# Altium schematic sheet DolphinController.SchDoc
size C
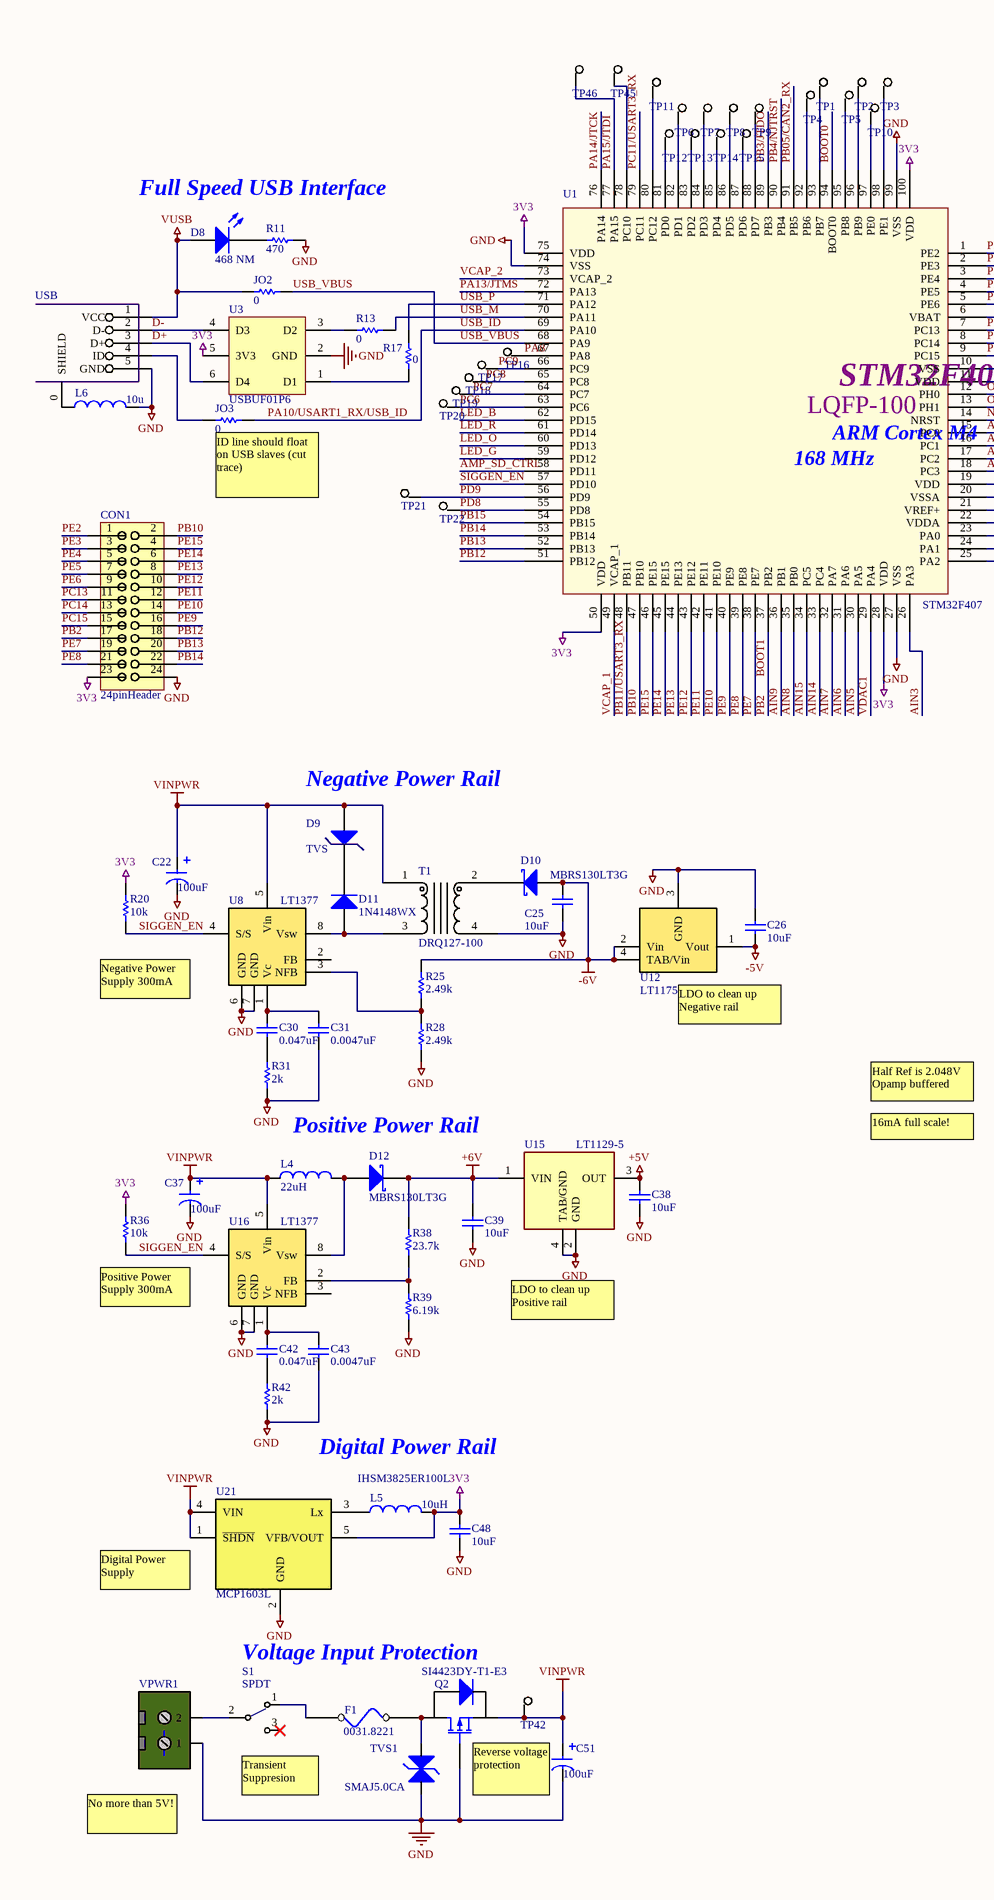
[diagram p0: DolphinController.SchDoc, left]
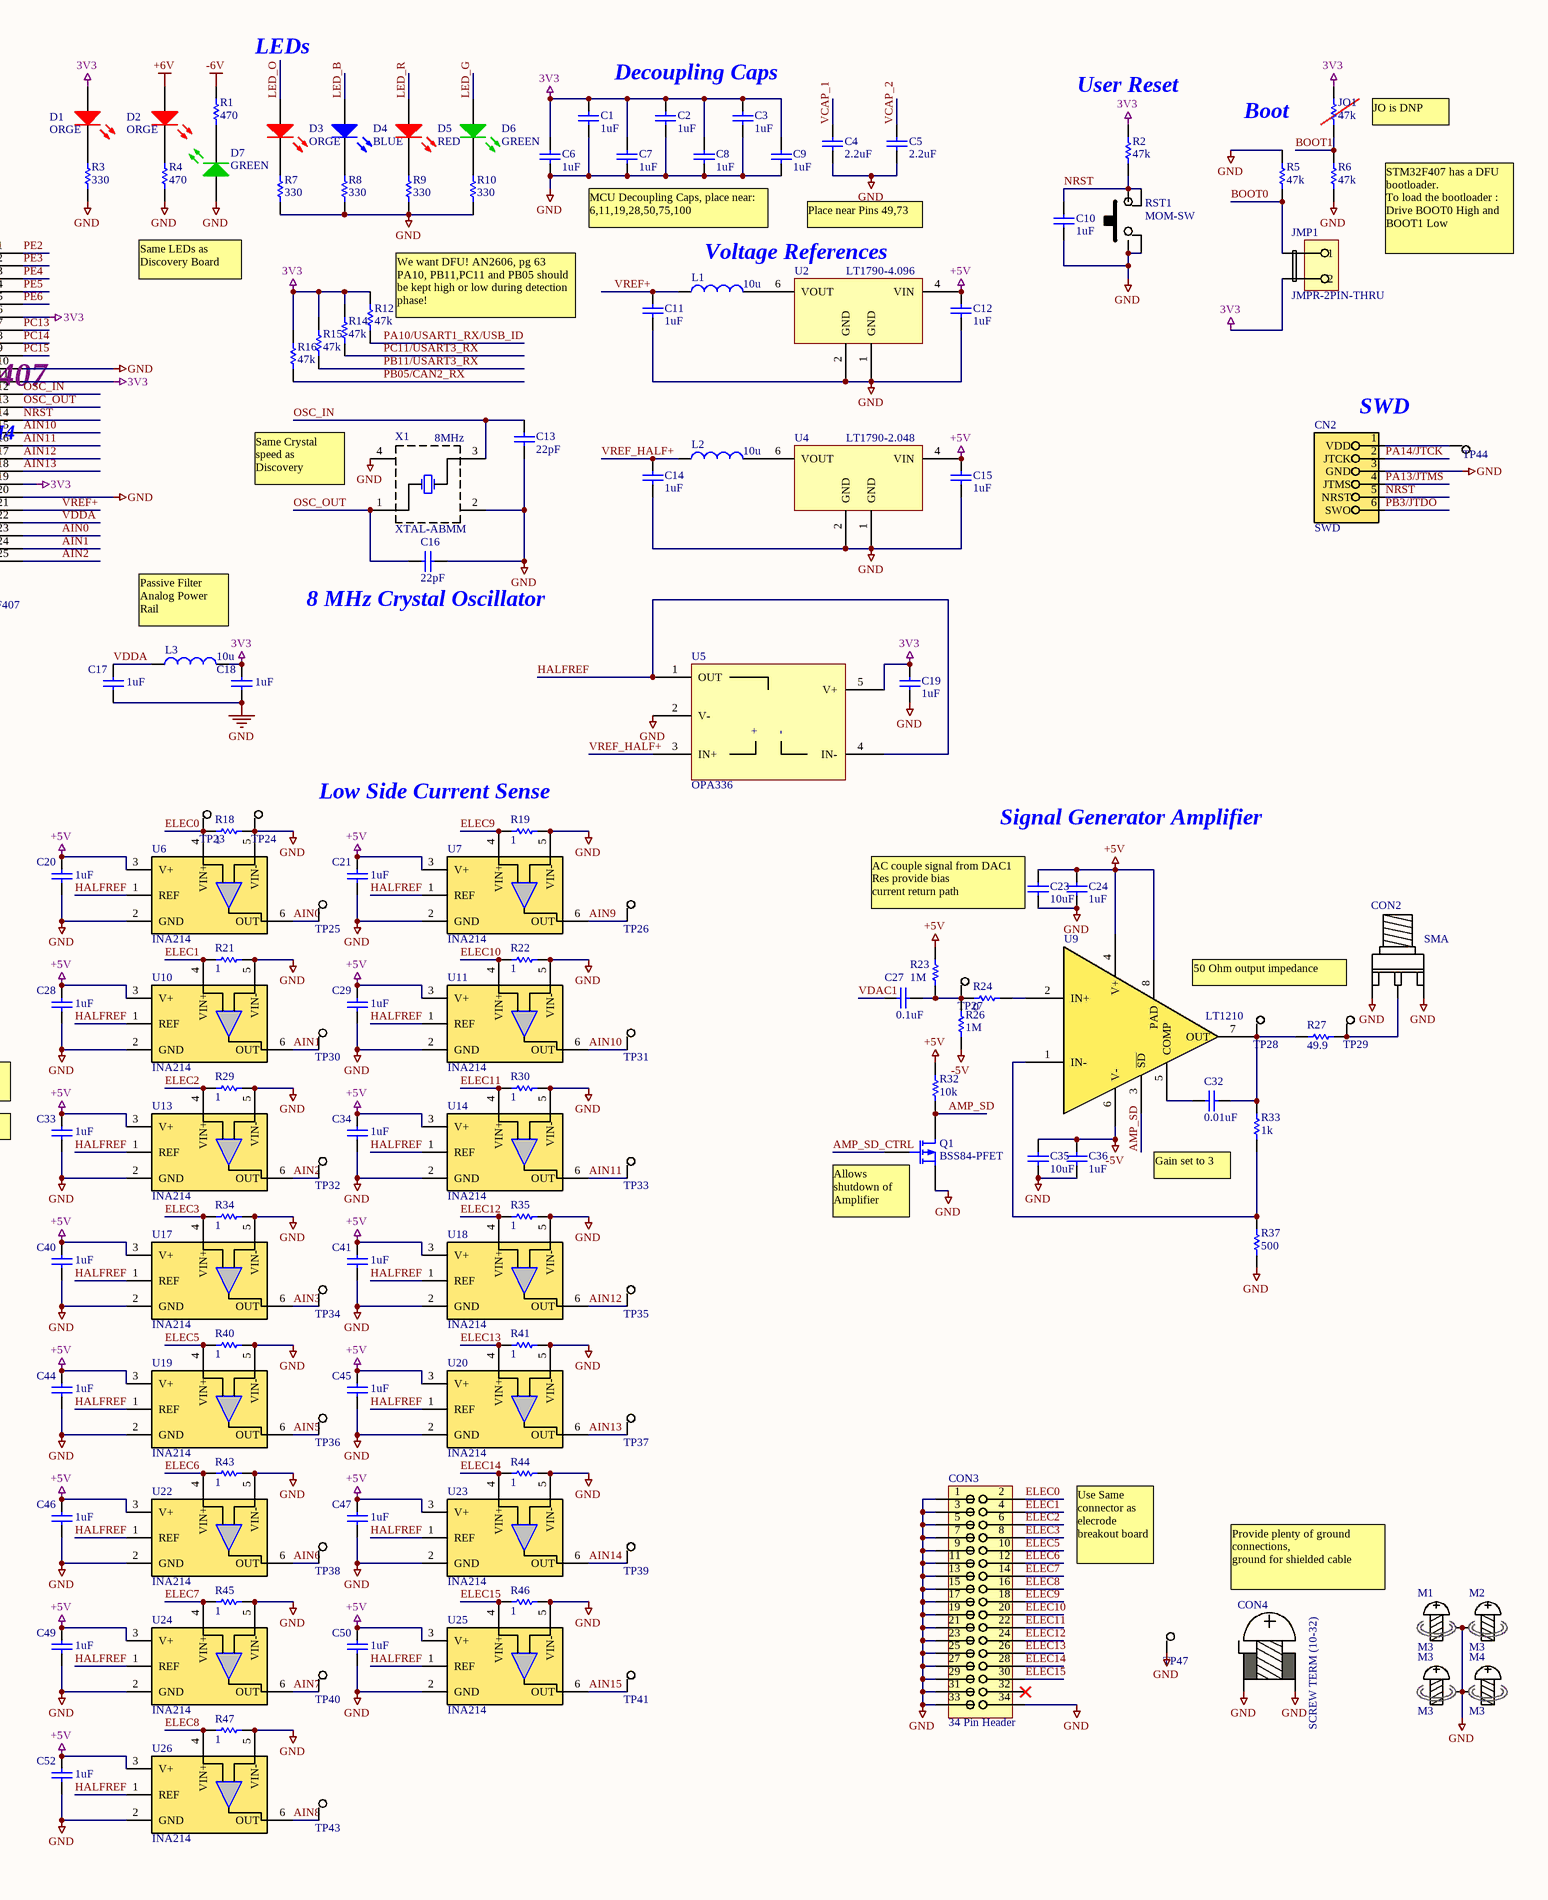
[diagram p1: DolphinController.SchDoc, right]

## Parts
C1  Label: 1uF  [SM/C_0402]  (hidden comment: CAP)
C2  Label: 1uF  [SM/C_0402]  (hidden comment: CAP)
C3  Label: 1uF  [SM/C_0402]  (hidden comment: CAP)
C4  Label: 2.2uF  [SM/C_0402]  (hidden comment: CAP)
C5  Label: 2.2uF  [SM/C_0402]  (hidden comment: CAP)
C6  Label: 1uF  [SM/C_0402]  (hidden comment: CAP)
C7  Label: 1uF  [SM/C_0402]  (hidden comment: CAP)
C8  Label: 1uF  [SM/C_0402]  (hidden comment: CAP)
C9  Label: 1uF  [SM/C_0402]  (hidden comment: CAP)
C10  Label: 1uF  [SM/C_0402]  (hidden comment: CAP)
C11  Label: 1uF  [SM/C_0402]  (hidden comment: CAP)
C12  Label: 1uF  [SM/C_0402]  (hidden comment: CAP)
C13  Label: 22pF  [SM/C_0402]  (hidden comment: CAP)
C14  Label: 1uF  [SM/C_0402]  (hidden comment: CAP)
C15  Label: 1uF  [SM/C_0402]  (hidden comment: CAP)
C16  Label: 22pF  [SM/C_0402]  (hidden comment: CAP)
C17  Label: 1uF  [SM/C_0402]  (hidden comment: CAP)
C18  Label: 1uF  [SM/C_0402]  (hidden comment: CAP)
C19  Label: 1uF  [SM/C_0402]  (hidden comment: CAP)
C20  Label: 1uF  [SM/C_0402]  (hidden comment: CAP)
C21  Label: 1uF  [SM/C_0402]  (hidden comment: CAP)
C22  Label: 100uF  [SM/CT_6032_12]  (hidden comment: CAP_POL)
C23  Label: 10uF  [SM/C_0805]  (hidden comment: CAP)
C24  Label: 1uF  [SM/C_0402]  (hidden comment: CAP)
C25  Label: 10uF  [SM/C_0805]  (hidden comment: CAP)
C26  Label: 10uF  [SM/C_0805]  (hidden comment: CAP)
C27  Label: 0.1uF  [SM/C_0402]  (hidden comment: CAP)
C28  Label: 1uF  [SM/C_0402]  (hidden comment: CAP)
C29  Label: 1uF  [SM/C_0402]  (hidden comment: CAP)
C30  Label: 0.047uF  [SM/C_0402]  (hidden comment: CAP)
C31  Label: 0.0047uF  [SM/C_0402]  (hidden comment: CAP)
C32  Label: 0.01uF  [SM/C_0402]  (hidden comment: CAP)
C33  Label: 1uF  [SM/C_0402]  (hidden comment: CAP)
C34  Label: 1uF  [SM/C_0402]  (hidden comment: CAP)
C35  Label: 10uF  [SM/C_0805]  (hidden comment: CAP)
C36  Label: 1uF  [SM/C_0402]  (hidden comment: CAP)
C37  Label: 100uF  [SM/CT_6032_12]  (hidden comment: CAP_POL)
C38  Label: 10uF  [SM/C_0805]  (hidden comment: CAP)
C39  Label: 10uF  [SM/C_0805]  (hidden comment: CAP)
C40  Label: 1uF  [SM/C_0402]  (hidden comment: CAP)
C41  Label: 1uF  [SM/C_0402]  (hidden comment: CAP)
C42  Label: 0.047uF  [SM/C_0402]  (hidden comment: CAP)
C43  Label: 0.0047uF  [SM/C_0402]  (hidden comment: CAP)
C44  Label: 1uF  [SM/C_0402]  (hidden comment: CAP)
C45  Label: 1uF  [SM/C_0402]  (hidden comment: CAP)
C46  Label: 1uF  [SM/C_0402]  (hidden comment: CAP)
C47  Label: 1uF  [SM/C_0402]  (hidden comment: CAP)
C48  Label: 10uF  [SM/C_0805]  (hidden comment: CAP)
C49  Label: 1uF  [SM/C_0402]  (hidden comment: CAP)
C50  Label: 1uF  [SM/C_0402]  (hidden comment: CAP)
C51  Label: 100uF  [SM/CT_6032_12]  (hidden comment: CAP_POL)
C52  Label: 1uF  [SM/C_0402]  (hidden comment: CAP)
CN2  SWD
CON1  24pinHeader  [CONN-RECEPT-24PIN]
CON2  SMA  [SMA-SMA-VERT]
CON3  34 Pin Header  [34Pin-Rectangular Header-SurfaceMount-100milSpacing]
CON4  SCREW TERM (10-32)  [LOW-PROFILE-SCREWTERMINAL]
D1  ORGE  [LED-0603]
D2  ORGE  [LED-0603]
D3  ORGE  [LED-0603]
D4  BLUE  [LED-0603]
D5  RED  [LED-0603]
D6  GREEN  [LED-0603]
D7  GREEN  [LED-0603]
D8  468 NM  [LED-0603]
D9  TVS  [D0-214AC]
D10  MBRS130LT3G  [D0-214AC]
D11  1N4148WX  [SOD323 - MCC - 1N4148WX]
D12  MBRS130LT3G  [D0-214AC]
F1  0031.8221  [SCHURTER/SMD/2 PADS/0031.8221]
JMP1  JMPR-2PIN-THRU  [M02]
JO1  value 47k  [SM/R_0402]  (hidden comment: Res)
JO2  value 0  [SM/R_0402]  (hidden comment: Res)
JO3  value 0  [SM/R_0402]  (hidden comment: Res)
L1  value 10u  [SM/L_0805]  (hidden comment: Inductor)
L2  value 10u  [SM/L_0805]  (hidden comment: Inductor)
L3  value 10u  [SM/L_0805]  (hidden comment: Inductor)
L4  22uH  [G_JMETRIC/TDK/SLE10145]
L5  IHSM3825ER100L  value 10uH  [INDUCTOR POWER 10UH 1.74A SMD]
L6  value 10u  [SM/L_0805]  (hidden comment: Inductor)
M1  M3  [MOUNTING_HOLE-125mil]
M2  M3  [MOUNTING_HOLE-125mil]
M3  M3  [MOUNTING_HOLE-125mil]
M4  M3  [MOUNTING_HOLE-125mil]
Q1  BSS84-PFET  [SOT23-BSS84-P-MOSFET]
Q2  SI4423DY-T1-E3  [SOIC-8-Lead-Vishay-PFET]
R1  value 470  [SM/R_0402]  (hidden comment: Res)
R2  value 47k  [SM/R_0402]  (hidden comment: Res)
R3  value 330  [SM/R_0402]  (hidden comment: Res)
R4  value 470  [SM/R_0402]  (hidden comment: Res)
R5  value 47k  [SM/R_0402]  (hidden comment: Res)
R6  value 47k  [SM/R_0402]  (hidden comment: Res)
R7  value 330  [SM/R_0402]  (hidden comment: Res)
R8  value 330  [SM/R_0402]  (hidden comment: Res)
R9  value 330  [SM/R_0402]  (hidden comment: Res)
R10  value 330  [SM/R_0402]  (hidden comment: Res)
R11  value 470  [SM/R_0402]  (hidden comment: Res)
R12  value 47k  [SM/R_0402]  (hidden comment: Res)
R13  value 0  [SM/R_0402]  (hidden comment: Res)
R14  value 47k  [SM/R_0402]  (hidden comment: Res)
R15  value 47k  [SM/R_0402]  (hidden comment: Res)
R16  value 47k  [SM/R_0402]  (hidden comment: Res)
R17  value 0  [SM/R_0402]  (hidden comment: Res)
R18  value 1  [SM/R_1206]  (hidden comment: Res)
R19  value 1  [SM/R_1206]  (hidden comment: Res)
R20  value 10k  [SM/R_0402]  (hidden comment: Res)
R21  value 1  [SM/R_1206]  (hidden comment: Res)
R22  value 1  [SM/R_1206]  (hidden comment: Res)
R23  value 1M  [SM/R_0402]  (hidden comment: Res)
R24  value 0  [SM/R_0402]  (hidden comment: Res)
R25  value 2.49k  [SM/R_0402]  (hidden comment: Res)
R26  value 1M  [SM/R_0402]  (hidden comment: Res)
R27  value 49.9  [SM/R_2512]  (hidden comment: Res)
R28  value 2.49k  [SM/R_0402]  (hidden comment: Res)
R29  value 1  [SM/R_1206]  (hidden comment: Res)
R30  value 1  [SM/R_1206]  (hidden comment: Res)
R31  value 2k  [SM/R_0402]  (hidden comment: Res)
R32  value 10k  [SM/R_0402]  (hidden comment: Res)
R33  value 1k  [SM/R_0402]  (hidden comment: Res)
R34  value 1  [SM/R_1206]  (hidden comment: Res)
R35  value 1  [SM/R_1206]  (hidden comment: Res)
R36  value 10k  [SM/R_0402]  (hidden comment: Res)
R37  value 500  [SM/R_0402]  (hidden comment: Res)
R38  value 23.7k  [SM/R_0402]  (hidden comment: Res)
R39  value 6.19k  [SM/R_0402]  (hidden comment: Res)
R40  value 1  [SM/R_1206]  (hidden comment: Res)
R41  value 1  [SM/R_1206]  (hidden comment: Res)
R42  value 2k  [SM/R_0402]  (hidden comment: Res)
R43  value 1  [SM/R_1206]  (hidden comment: Res)
R44  value 1  [SM/R_1206]  (hidden comment: Res)
R45  value 1  [SM/R_1206]  (hidden comment: Res)
R46  value 1  [SM/R_1206]  (hidden comment: Res)
R47  value 1  [SM/R_1206]  (hidden comment: Res)
RST1  MOM-SW  [MOM-SW]
S1  SPDT  [SW_Lseries]
T1  DRQ127-100  [DRQ127-100]
TP1  TEST_PT  [TEST_PT_SMD]  (value not drawn)
TP2  TEST_PT  [TEST_PT_SMD]  (value not drawn)
TP3  TEST_PT  [TEST_PT_SMD]  (value not drawn)
TP4  TEST_PT  [TEST_PT_SMD]  (value not drawn)
TP5  TEST_PT  [TEST_PT_SMD]  (value not drawn)
TP6  TEST_PT  [TEST_PT_SMD]  (value not drawn)
TP7  TEST_PT  [TEST_PT_SMD]  (value not drawn)
TP8  TEST_PT  [TEST_PT_SMD]  (value not drawn)
TP9  TEST_PT  [TEST_PT_SMD]  (value not drawn)
TP10  TEST_PT  [TEST_PT_SMD]  (value not drawn)
TP11  TEST_PT  [TEST_PT_SMD]  (value not drawn)
TP12  TEST_PT  [TEST_PT_SMD]  (value not drawn)
TP13  TEST_PT  [TEST_PT_SMD]  (value not drawn)
TP14  TEST_PT  [TEST_PT_SMD]  (value not drawn)
TP15  TEST_PT  [TEST_PT_SMD]  (value not drawn)
TP16  TEST_PT  [TEST_PT_SMD]  (value not drawn)
TP17  TEST_PT  [TEST_PT_SMD]  (value not drawn)
TP18  TEST_PT  [TEST_PT_SMD]  (value not drawn)
TP19  TEST_PT  [TEST_PT_SMD]  (value not drawn)
TP20  TEST_PT  [TEST_PT_SMD]  (value not drawn)
TP21  TEST_PT  [TEST_PT_SMD]  (value not drawn)
TP22  TEST_PT  [TEST_PT_SMD]  (value not drawn)
TP23  TEST_PT  [TEST_PT_SMD]  (value not drawn)
TP24  TEST_PT  [TEST_PT_SMD]  (value not drawn)
TP25  TEST_PT  [TEST_PT_SMD]  (value not drawn)
TP26  TEST_PT  [TEST_PT_SMD]  (value not drawn)
TP27  TEST_PT  [TEST_PT_SMD]  (value not drawn)
TP28  TEST_PT  [TEST_PT_SMD]  (value not drawn)
TP29  TEST_PT  [TEST_PT_SMD]  (value not drawn)
TP30  TEST_PT  [TEST_PT_SMD]  (value not drawn)
TP31  TEST_PT  [TEST_PT_SMD]  (value not drawn)
TP32  TEST_PT  [TEST_PT_SMD]  (value not drawn)
TP33  TEST_PT  [TEST_PT_SMD]  (value not drawn)
TP34  TEST_PT  [TEST_PT_SMD]  (value not drawn)
TP35  TEST_PT  [TEST_PT_SMD]  (value not drawn)
TP36  TEST_PT  [TEST_PT_SMD]  (value not drawn)
TP37  TEST_PT  [TEST_PT_SMD]  (value not drawn)
TP38  TEST_PT  [TEST_PT_SMD]  (value not drawn)
TP39  TEST_PT  [TEST_PT_SMD]  (value not drawn)
TP40  TEST_PT  [TEST_PT_SMD]  (value not drawn)
TP41  TEST_PT  [TEST_PT_SMD]  (value not drawn)
TP42  TEST_PT  [TEST_PT_SMD]  (value not drawn)
TP43  TEST_PT  [TEST_PT_SMD]  (value not drawn)
TP44  TEST_PT  [TEST_PT_SMD]  (value not drawn)
TP45  TEST_PT  [TEST_PT_SMD]  (value not drawn)
TP46  TEST_PT  [TEST_PT_SMD]  (value not drawn)
TP47  TEST_PT  [TEST_PT_SMD]  (value not drawn)
TVS1  SMAJ5.0CA  [D0-214AC]
U1  STM32F407  [LQFP100 14x14mm]
U2  LT1790-4.096  [LT1790--VREF-TSOT23]
U3  USBUF01P6  [USB-EMI-STM-USBUF01P6-SOT666IP]
U4  LT1790-2.048  [LT1790--VREF-TSOT23]
U5  OPA336  [SOT23-5 -TI]
U6  INA214  [SC70-6pin-TI]
U7  INA214  [SC70-6pin-TI]
U8  LT1377  [SOIC-8Pin-Linear]
U9  LT1210  [DDPak-7Lead-LinearTech]
U10  INA214  [SC70-6pin-TI]
U11  INA214  [SC70-6pin-TI]
U12  LT1175  [SOT223-3Lead-STPackage-LinearTechLT1129-3.3]
U13  INA214  [SC70-6pin-TI]
U14  INA214  [SC70-6pin-TI]
U15  LT1129-5  [SOT223-3Lead-STPackage-LinearTechLT1129-3.3]
U16  LT1377  [SOIC-8Pin-Linear]
U17  INA214  [SC70-6pin-TI]
U18  INA214  [SC70-6pin-TI]
U19  INA214  [SC70-6pin-TI]
U20  INA214  [SC70-6pin-TI]
U21  MCP1603L  [TSOT-5Lead-MCP1603/B/L]
U22  INA214  [SC70-6pin-TI]
U23  INA214  [SC70-6pin-TI]
U24  INA214  [SC70-6pin-TI]
U25  INA214  [SC70-6pin-TI]
U26  INA214  [SC70-6pin-TI]
USB  USB MiniB  [USB-MINIB]  (value not drawn)
VPWR1  TERM BLOCK 2POS  [Conn-ScrewTerminal-2pin-Phoenix]  (value not drawn)
X1  XTAL-ABMM  value 8MHz  [ABMM-Crystal]

## Nets
3V3: C1.2 C2.2 C3.2 C6.2 C7.2 C8.2 C9.2 C18.2 C19.2 C48.2 CON1.23 D1.1(A) JMP1.2 JO1.2 L3.2 L5.2 R2.2 R12.2 R14.2 R15.2 R16.2 R20.1 R36.1 U1.6(VBAT) U1.11(VDD) U1.19(VDD) U1.28(VDD) U1.50(VDD) U1.75(VDD) U1.100(VDD) U3.5(3V3) U5.5(V+) U21.5(VFB/VOUT)
+5V: C12.2 C15.2 C20.2 C21.2 C23.2 C24.2 C28.2 C29.2 C33.2 C34.2 C38.2 C40.2 C41.2 C44.2 C45.2 C46.2 C47.2 C49.2 C50.2 C52.2 R23.2 R32.2 U2.4(VIN) U4.4(VIN) U6.3(V+) U7.3(V+) U9.4(V+) U9.8(PAD) U10.3(V+) U11.3(V+) U13.3(V+) U14.3(V+) U15.3(OUT) U17.3(V+) U18.3(V+) U19.3(V+) U20.3(V+) U22.3(V+) U23.3(V+) U24.3(V+) U25.3(V+) U26.3(V+)
+6V: C39.2 D2.1(A) D12.C R38.1 U15.1(VIN)
-5V: C26.1 C35.2 C36.2 R26.2 U9.6(V-) U12.1(Vout)
-6V: C25.2 D10.A R1.1 R25.1 U12.2(Vin) U12.4(TAB/Vin)
GND: C1.1 C2.1 C3.1 C4.1 C5.1 C6.1 C7.1 C8.1 C9.1 C10.1 C11.1 C12.1 C13.1 C14.1 C15.1 C16.2 C17.1 C18.1 C19.1 C20.1 C21.1 C22.2 C23.1 C24.1 C25.1 C26.2 C28.1 C29.1 C31.1 C33.1 C34.1 C35.1 C36.1 C37.2 C38.1 C39.1 C40.1 C41.1 C43.1 C44.1 C45.1 C46.1 C47.1 C48.1 C49.1 C50.1 C51.2 C52.1 CN2.3(GND) CON1.24 CON2.0 CON3.1 CON3.3 CON3.5 CON3.7 CON3.9 CON3.11 CON3.13 CON3.15 CON3.17 CON3.19 CON3.21 CON3.23 CON3.25 CON3.27 CON3.29 CON3.31 CON3.33 CON3.34 CON4.1 D7.1(A) L6.2 M1.0(PAD) M2.0(PAD) M3.0(PAD) M4.0(PAD) Q1.3(S) Q2.G R3.2 R4.2 R5.2 R6.1 R7.1 R8.1 R9.1 R10.1 R11.1 R18.2 R19.2 R21.2 R22.2 R28.2 R29.2 R30.2 R31.2 R34.2 R35.2 R37.1 R39.2 R40.2 R41.2 R42.2 R43.2 R44.2 R45.2 R46.2 R47.2 RST1.1 RST1.2 T1.4 TP24.1(TP?) TP47.1(TP?) TVS1.C U1.10(VSS) U1.20(VSSA) U1.27(VSS) U1.74(VSS) U1.99(VSS) U2.1(GND) U2.2(GND) U3.2(GND) U4.1(GND) U4.2(GND) U5.2(V-) U6.2(GND) U6.5(VIN-) U7.2(GND) U7.5(VIN-) U8.6(GND) U8.7(GND) U10.2(GND) U10.5(VIN-) U11.2(GND) U11.5(VIN-) U12.3(GND) U13.2(GND) U13.5(VIN-) U14.2(GND) U14.5(VIN-) U15.2(GND) U15.4(TAB/GND) U16.6(GND) U16.7(GND) U17.2(GND) U17.5(VIN-) U18.2(GND) U18.5(VIN-) U19.2(GND) U19.5(VIN-) U20.2(GND) U20.5(VIN-) U21.2(GND) U22.2(GND) U22.5(VIN-) U23.2(GND) U23.5(VIN-) U24.2(GND) U24.5(VIN-) U25.2(GND) U25.5(VIN-) U26.2(GND) U26.5(VIN-) USB.5(GND) VPWR1.1 X1.2 X1.4
VINPWR: C22.1 C37.1 C51.1 D9.A L4.2 Q2.S T1.1(P1) TP42.1(TP?) U8.5(Vin) U16.5(Vin) U21.1(~{SHDN}) U21.4(VIN)
VUSB: D8.1(A) JO2.2 USB.1(VCC)
AIN0: TP25.1(TP?) U1.23(PA0) U6.6(OUT)
AIN1: TP30.1(TP?) U1.24(PA1) U10.6(OUT)
AIN2: TP32.1(TP?) U1.25(PA2) U13.6(OUT)
AIN3: TP34.1(TP?) U1.26(PA3) U17.6(OUT)
AIN5: TP36.1(TP?) U1.30(PA5) U19.6(OUT)
AIN6: TP38.1(TP?) U1.31(PA6) U22.6(OUT)
AIN7: TP40.1(TP?) U1.32(PA7) U24.6(OUT)
AIN8: TP43.1(TP?) U1.35(PB0) U26.6(OUT)
AIN9: TP26.1(TP?) U1.36(PB1) U7.6(OUT)
AIN10: TP31.1(TP?) U1.15(PC0) U11.6(OUT)
AIN11: TP33.1(TP?) U1.16(PC1) U14.6(OUT)
AIN12: TP35.1(TP?) U1.17(PC2) U18.6(OUT)
AIN13: TP37.1(TP?) U1.18(PC3) U20.6(OUT)
AIN14: TP39.1(TP?) U1.33(PC4) U23.6(OUT)
AIN15: TP41.1(TP?) U1.34(PC5) U25.6(OUT)
AMP_SD: Q1.1(D) R32.1 U9.3(~{SD})
AMP_SD_CTRL: Q1.2(G) U1.58(PD11)
BOOT0: JMP1.1 R5.1 U1.94(BOOT0)
BOOT1: CON1.17 JO1.1 R6.2 U1.37(PB2)  [also labelled PB2]
D+: U3.6(D4) USB.3(D+)
D-: U3.4(D3) USB.2(D-)
ELEC0: CON3.2 R18.1 TP23.1(TP?) U6.4(VIN+)
ELEC1: CON3.4 R21.1 U10.4(VIN+)
ELEC2: CON3.6 R29.1 U13.4(VIN+)
ELEC3: CON3.8 R34.1 U17.4(VIN+)
ELEC5: CON3.10 R40.1 U19.4(VIN+)
ELEC6: CON3.12 R43.1 U22.4(VIN+)
ELEC7: CON3.14 R45.1 U24.4(VIN+)
ELEC8: CON3.16 R47.1 U26.4(VIN+)
ELEC9: CON3.18 R19.1 U7.4(VIN+)
ELEC10: CON3.20 R22.1 U11.4(VIN+)
ELEC11: CON3.22 R30.1 U14.4(VIN+)
ELEC12: CON3.24 R35.1 U18.4(VIN+)
ELEC13: CON3.26 R41.1 U20.4(VIN+)
ELEC14: CON3.28 R44.1 U23.4(VIN+)
ELEC15: CON3.30 R46.1 U25.4(VIN+)
HALFREF: U5.1(OUT) U5.4(IN-) U6.1(REF) U7.1(REF) U10.1(REF) U11.1(REF) U13.1(REF) U14.1(REF) U17.1(REF) U18.1(REF) U19.1(REF) U20.1(REF) U22.1(REF) U23.1(REF) U24.1(REF) U25.1(REF) U26.1(REF)
LED_B: D4.1(A) U1.62(PD15)
LED_G: D6.1(A) U1.59(PD12)
LED_O: D3.1(A) U1.60(PD13)
LED_R: D5.1(A) U1.61(PD14)
NRST: C10.2 CN2.5(NRST) R2.1 RST1.3 RST1.4 U1.14(NRST)
OSC_IN: C13.2 U1.12(PH0) X1.3
OSC_OUT: C16.1 U1.13(PH1) X1.1
PA8: TP16.1(TP?) U1.67(PA8)
PA10/USART1_RX/USB_ID: JO3.1 R12.1 U1.69(PA10)  [also labelled USB_ID]
PA13/JTMS: CN2.4(JTMS) U1.72(PA13)
PA14/JTCK: CN2.2(JTCK) U1.76(PA14)
PA15/JTDI: TP46.1(TP?) U1.77(PA15)
PB3/JTDO: CN2.6(SWO) U1.89(PB3)
PB4/NJTRST: U1.90(PB4)
PB05/CAN2_RX: R16.1 U1.91(PB5)
PB10: CON1.2 U1.47(PB10)
PB11/USART3_RX: R15.1 U1.48(PB11)
PB12: CON1.18 U1.51(PB12)
PB13: CON1.20 U1.52(PB13)
PB14: CON1.22 U1.53(PB14)
PB15: U1.54(PB15)
PC6: TP20.1(TP?) U1.63(PC6)
PC7: TP19.1(TP?) U1.64(PC7)
PC8: TP18.1(TP?) U1.65(PC8)
PC9: TP17.1(TP?) U1.66(PC9)
PC11/USART3_RX: R14.1 U1.79(PC11)
PC13: CON1.11 U1.7(PC13)
PC14: CON1.13 U1.8(PC14)
PC15: CON1.15 U1.9(PC15)
PD8: TP22.1(TP?) U1.55(PD8)
PD9: TP21.1(TP?) U1.56(PD9)
PE2: CON1.1 U1.1(PE2)
PE3: CON1.3 U1.2(PE3)
PE4: CON1.5 U1.3(PE4)
PE5: CON1.7 U1.4(PE5)
PE6: CON1.9 U1.5(PE6)
PE7: CON1.19 U1.38(PE7)
PE8: CON1.21 U1.39(PE8)
PE9: CON1.16 U1.40(PE9)
PE10: CON1.14 U1.41(PE10)
PE11: CON1.12 U1.42(PE11)
PE12: CON1.10 U1.43(PE12)
PE13: CON1.8 U1.44(PE13)
PE14: CON1.6 U1.45(PE15)
PE15: CON1.4 U1.46(PE15)
SIGGEN_EN: R20.2 R36.2 U1.57(PD10) U8.4(S/S) U16.4(S/S)
USB_M: R13.1 U1.70(PA11)
USB_P: R17.2 U1.71(PA12)
USB_VBUS: JO2.1 U1.68(PA9)
VCAP_1: C4.2 U1.49(VCAP_1)
VCAP_2: C5.2 U1.73(VCAP_2)
VDAC1: C27.1 U1.29(PA4)
VDDA: C17.2 L3.1 U1.22(VDDA)
VREF+: C11.2 L1.1 U1.21(VREF+)
VREF_HALF+: C14.2 L2.1 U5.3(IN+)
NetC27_2: C27.2 R23.1 R24.2 R26.1 TP27.1(TP?)
NetC30_1: C30.1 R31.1
NetC30_2: C30.2 C31.2 U8.1(Vc)
NetC32_1: C32.1 U9.5(COMP)
NetC32_2: C32.2 R27.1 R33.2 TP28.1(TP?) U9.7(OUT)
NetC42_1: C42.1 R42.1
NetC42_2: C42.2 C43.2 U16.1(Vc)
NetCN2_1: CN2.1(VDD) TP44.1(TP?)
NetCON2_1: CON2.1 R27.2 TP29.1(TP?)
NetD1_2: D1.2(K) R3.1
NetD2_2: D2.2(K) R4.1
NetD3_2: D3.2(K) R7.2
NetD4_2: D4.2(K) R8.2
NetD5_2: D5.2(K) R9.2
NetD6_2: D6.2(K) R10.2
NetD7_2: D7.2(K) R1.2
NetD8_2: D8.2(K) R11.2
NetD9_C: D9.C D11.K
NetD10_C: D10.C T1.2
NetD11_A: D11.A T1.3 U8.8(Vsw)
NetD12_A: D12.A L4.1 U16.8(Vsw)
NetF1_1: F1.1 S1.1
NetF1_2: F1.2 Q2.D TVS1.A
NetJO3_2: JO3.2 USB.4(ID)
NetL1_2: L1.2 U2.6(VOUT)
NetL2_2: L2.2 U4.6(VOUT)
NetL5_1: L5.1 U21.3(Lx)
NetL6_1: L6.1 USB.0(SHIELD)
NetR13_2: R13.2 U3.3(D2)
NetR17_1: R17.1 U3.1(D1)
NetR24_1: R24.1 U9.2(IN+)
NetR25_2: R25.2 R28.1 U8.3(NFB)
NetR33_1: R33.1 R37.2 U9.1(IN-)
NetR38_2: R38.2 R39.1 U16.2(FB)
NetS1_2: S1.2 VPWR1.2
NetTP1_1: TP1.1(TP?) U1.93(PB7)
NetTP2_1: TP2.1(TP?) U1.96(PB9)
NetTP3_1: TP3.1(TP?) U1.98(PE1)
NetTP4_1: TP4.1(TP?) U1.92(PB6)
NetTP5_1: TP5.1(TP?) U1.95(PB8)
NetTP6_1: TP6.1(TP?) U1.82(PD1)
NetTP7_1: TP7.1(TP?) U1.84(PD3)
NetTP8_1: TP8.1(TP?) U1.86(PD5)
NetTP9_1: TP9.1(TP?) U1.88(PD7)
NetTP10_1: TP10.1(TP?) U1.97(PE0)
NetTP11_1: TP11.1(TP?) U1.80(PC12)
NetTP12_1: TP12.1(TP?) U1.81(PD0)
NetTP13_1: TP13.1(TP?) U1.83(PD2)
NetTP14_1: TP14.1(TP?) U1.85(PD4)
NetTP15_1: TP15.1(TP?) U1.87(PD6)
NetTP45_1: TP45.1(TP?) U1.78(PC10)

Not connected (* = marked no-connect by the designer): CON3 32*; S1 3*; U8 2(FB); U16 3(NFB)

## Notes on the sheet
- LEDs
- Decoupling Caps
- (near R2) User Reset
- Boot
- JO is DNP
- Full Speed USB Interface
- Same LEDs as Discovery Board
- MCU Decoupling Caps, place near:
  6,11,19,28,50,75,100
- Voltage References
- Place near Pins 49,73
- STM32F407 has a DFU bootloader.
  To load the bootloader :
  Drive BOOT0 High and BOOT1 Low
- (near R12) We want DFU! AN2606, pg 63
  PA10, PB11,PC11 and PB05 should be kept high or low during detection phase!
- (near U1) 168 MHz
- (near U1) ARM Cortex M4
- (near CN2) SWD
- (near JO3) ID line should float on USB slaves (cut trace)
- Same Crystal
  speed as
  Discovery
- Passive Filter
  Analog Power
  Rail
- (near C16) 8 MHz Crystal Oscillator
- (near D9) Negative Power Rail
- (near R19) Low Side Current Sense
- Signal Generator Amplifier
- (near C23) AC couple signal from DAC1
  Res provide bias
  current return path
- (near U9) 50 Ohm output impedance
- Negative Power
  Supply 300mA
- (near U12) LDO to clean up
  Negative rail
- Half Ref is 2.048V
  Opamp buffered
- Positive Power Rail
- 16mA full scale!
- (near R33) Gain set to 3
- (near Q1) Allows shutdown of
  Amplifier
- Positive Power
  Supply 300mA
- LDO to clean up
  Positive rail
- Digital Power Rail
- Use Same connector as elecrode breakout board
- (near U21) Digital Power Supply
- Provide plenty of ground connections,
  ground for shielded cable
- Voltage Input Protection
- (near S1) Transient Suppresion
- (near Q2) Reverse voltage protection
- No more than 5V!
- (in symbol OPA335) +; -
- (in symbol STM32F407) LQFP-100

## Library data of the parts
C1-C3 C6-C12 C14 C15 C17-C21 C24 C28 C29 C33 C34 C36 C40 C41 C44-C47 C49 C50 C52 = CAP: Value: 1uF
C4 C5 = CAP: Value: 2.2uF
C13 C16 = CAP: Value: 22pF
C22 C37 C51 = CAP_POL: CAP; Value: 100uF
C23 C25 C26 C35 C38 C39 C48 = CAP: Value: 10uF
C27 = CAP: Value: 0.1uF
C30 C42 = CAP: Value: 0.047uF
C31 C43 = CAP: Value: 0.0047uF
C32 = CAP: Value: 0.01uF
CN2 = SWD-STM32F4-Program-Header
CON2 = SMA-THRU-VERT
CON3 = 34pinHeader
CON4 = ScrewTerminal-PCB-ThruHole
D1-D3 D5 = 2002: LED SUPER RED CLEAR 0603 SMD; mfrName: LITE-ON INC; mfrPartNum: LTST-C190KRKT; Extra_Description: Datasheets	LTST-C190KRKT / Product Photos	LTST-C190KGKT, LTST-C190KGKT, LTST-C190KSKT, LTST-C190KYKT / Catalog Drawings	LED 0603 Series / LED 0603 Series Side / Standard Package	1 / Category	Optoelectronics / Family	LEDs - <75mA, Discrete / Series	- / Color	Red / Luminous Flux @ Current - Test	196 mlm / Current - Test	20mA / Wavelength - Dominant	631nm / Wavelength - Peak	639nm / Millicandela Rating	54mcd / Voltage - Forward (Vf) Typ	2.0V / Lens Type	Clear / Lens Style/Size	Rectangle, 1.06mm x 0.8mm / Package / Case	0603 (1608 Metric) / Mounting Type	Surface Mount / Viewing Angle	130° / Packaging	Cut Tape (CT) / Size / Dimension	* / Height	* / Catalog Page	2744 (US2010 Interactive) / 2744 (US2010 PDF) / Other Names	160-1436-1; Obsolete: False; Temp_Max: 0; Type: UNKNOWN; Published: 8-Jun-2000; LatestRevisionDate: 17-Jul-2002; LatestRevisionNote: Re-released for DXP Platform.; PackageVersion: Feb-2002; PackageReference: 3.2X1.6X1.1; Publisher: Altium Limited; PartID: 2002; URL_Image: http://media.digikey.com/photos/Lite%20On%20Photos/LTST-C190KGKT,LTST-C190KRKT,LTST-C190KSKT,LTST-C190KYKT_sml.jpg; URL_Datasheet: http://optoelectronics.liteon.com/en-us/api/DwonloadFileHandler.ashx?txtSpecNo=DS-22-99-0151&txtPartNo=LTST-C190KRKT; Date_Created: 7/8/2010 11:36:30 PM; Date_LastModified: 7/8/2010 11:36:30 PM; Verified: False; RoHS: True; Temp_Min: 0
D4 D8 = 2001: LED 468NM BLUE CLEAR 0603 SMD; mfrName: LITE-ON INC; mfrPartNum: LTST-C190TBKT; Extra_Description: Datasheets	LTST-C190TBKT / Product Photos	LTST-C190TBKT, LTST-C190KFKT, LTST-C190KAKT / Catalog Drawings	LED 0603 Series / LED 0603 Series Side / Standard Package	1 / Category	Optoelectronics / Family	LEDs - <75mA, Discrete / Series	- / Color	Blue / Luminous Flux @ Current - Test	109 mlm / Current - Test	20mA / Wavelength - Dominant	470nm / Wavelength - Peak	468nm / Millicandela Rating	30mcd / Voltage - Forward (Vf) Typ	3.4V / Lens Type	Clear / Lens Style/Size	Rectangle, 1.06mm x 0.8mm / Package / Case	0603 (1608 Metric) / Mounting Type	Surface Mount / Viewing Angle	130° / Packaging	Digi-Reel® / Size / Dimension	* / Height	* / Other Names	160-1646-6; Obsolete: False; Temp_Max: 0; Type: UNKNOWN; Published: 8-Jun-2000; LatestRevisionDate: 17-Jul-2002; LatestRevisionNote: Re-released for DXP Platform.; PackageVersion: Feb-2002; PackageReference: 3.2X1.6X1.1; Publisher: Altium Limited; PartID: 2001; URL_Image: http://media.digikey.com/photos/Lite%20On%20Photos/LTST-C190TBKT,LTST-C190KAKT,LTST-C190KFKT_sml.jpg; URL_Datasheet: http://media.digikey.com/pdf/Data%20Sheets/Lite-On%20PDFs/LTST-C190TBKT.pdf; Date_Created: 7/8/2010 11:30:06 PM; Date_LastModified: 7/8/2010 11:30:06 PM; Verified: False; RoHS: True; Temp_Min: 0
D6 D7 = 2067: LED GREEN CLEAR 0603 SMD; mfrName: LITE-ON INC; mfrPartNum: LTST-C190GKT; Extra_Description: Datasheets	LTST-C190GKT / Product Photos	LTST-C190AKT,LTST-C190CKT,LTST-C190EKT,LTST-C190GKT,LTST-C190YKT / Catalog Drawings	LED 0603 Series / LED 0603 Series Side / Standard Package	1 / Category	Optoelectronics / Family	LEDs - <75mA, Discrete / Series	- / Color	Green / Luminous Flux @ Current - Test	- / Current - Test	10mA / Wavelength - Dominant	569nm / Wavelength - Peak	565nm / Millicandela Rating	6mcd / Voltage - Forward (Vf) Typ	2.1V / Lens Type	Clear / Lens Style/Size	Rectangle, 1.1mm x 0.8mm / Package / Case	0603 (1608 Metric) / Mounting Type	Surface Mount / Viewing Angle	130° / Packaging	Cut Tape (CT) / Catalog Page	2743 (US2010 Interactive) / 2743 (US2010 PDF) / Other Names	160-1183-1; Obsolete: False; Temp_Max: 0; Type: Optoelectronics; Published: 8-Jun-2000; LatestRevisionDate: 17-Jul-2002; LatestRevisionNote: Re-released for DXP Platform.; PackageVersion: Feb-2002; PackageReference: 3.2X1.6X1.1; Publisher: Altium Limited; PartID: 2067; URL_Image: HTTP://MEDIA.DIGIKEY.COM/PHOTOS/LITE%20ON%20PHOTOS/LTST-C190AKT,LTST-C190CKT,LTST-C190EKT,LTST-C190GKT,LTST-C190YKT.JPG; URL_Datasheet: http://media.digikey.com/pdf/Data%20Sheets/Lite-On%20PDFs/LTST-C190GKT.pdf?cshift_ck=null&client_id=5042&cshift_ck=null&client_id=5042&cshift_ck=null&client_id=5042&cshift_ck=null&client_id=5042; Date_Created: 9/27/2010 6:09:47 PM; Date_LastModified: 9/27/2010 6:09:47 PM; Verified: False; RoHS: True; Temp_Min: 0
D10 D12 = Schottky Diode_AC
D11 = Diode-1N4148WX
F1 = 2105: FUSEHOLDER BLACK FOR SMD 5X20MM; mfrName: Schurter Inc; Extra_Description: Standard Package == 100 / Category == Circuit Protection / Family == Fuseholders / Series == OGN / Type == Holder / Fuse Size == 5mm x 20mm / Number of Circuits == 1 / Mounting Type == Surface Mount / Termination Style == Surface Mount (SMD,SMT) / Voltage == 500V / Current Rating == 10A / Material == Copper Alloy, Tin Plated / Catalog Page == 2139 (US2010 Interactive) / Other Names == 0031.8221-ND486-1260; Obsolete: False; Temp_Max: 0; Type: Fuseholders; TypeNotes: Added 12/11/2010 2:44:25 PM; PartID: 2105; mfrPartNum: 0031.8221; URL_Image: HTTP://MEDIA.DIGIKEY.COM/PHOTOS/SCHURTER%20PHOTOS/0031.8221.JPG; URL_Datasheet: http://www.schurterinc.com/var/schurter/storage/ilcatalogue/files/document/datasheet/en/pdf/typ_OGN-SMD.pdf; Date_Created: 12/11/2010 2:47:02 PM; Date_LastModified: 12/11/2010 2:47:02 PM; Verified: False; RoHS: True; Temp_Min: 0
JO1-JO3 R1-R47 = Res: Resistor; Published: 8-Jun-2000; LatestRevisionDate: 17-Jul-2002; LatestRevisionNote: Re-released for DXP Platform.; PackageReference: AXIAL-0.3; Publisher: Altium Limited
L4 = 1660: INDUCTOR SHIELD PWR 22UH 10145; mfrName: TDK Corporation; mfrPartNum: SLF10145T-220M1R9-PF; Extra_Description: TDK Corporation / Inductance22µH / Tolerance±20% / SeriesSLF / Package / Case10.1mm x 10.1mm x 4.5mm / PackagingCut Tape (CT) / TypeFerrite Core / Current1.9A / Lead Free StatusLead Free / RoHS StatusRoHS Compliant / Other Names445-1981-1; Type: Fixed; PartID: 1660; URL_Datasheet: http://www.digikey.com/scripts/DkSearch/dksus.dll?Pname?Name=445-1981-1-ND&Site=US; Date_Created: 4/21/2006 2:20:33 PM; Date_LastModified: 8/21/2009 1:12:56 AM; Verified: False
L5 = INDUCTOR_POWER_10UH_1.74A_SMD
M1-M4 = MountingHole
Q1 = BSS84-MOSFET-P: P-Channel MOSFET; Published: 8-Jun-2000; LatestRevisionDate: 17-Jul-2002; LatestRevisionNote: Re-released for DXP Platform.; PackageVersion: 1995/1996; PackageReference: E3; Publisher: Altium Limited
Q2 = 2390: mosfet,p ch,20v,10a,8soic; transistor polarity:p channel;; mfrName: Vishay; Extra_Description: MOSFET,P CH,20V,10A,8SOIC; Transistor Polarity:P Channel; Drain Source Voltage Vds:-20V; On Resistance Rds(on):6mohm; Rds(on) Test Voltage Vgs:-4.5V; Operating Temperature Range:-55°C to +150°C; Transistor Case Style:SOIC; No. of Pins:8; SVHC:No SVHC (15-Dec-2010); Current Id Max:-10A; Power Dissipation Pd:1.5W; Voltage Vgs Max:-8V / Polarity: ``P-Channel`` / Case / Package: ``SO-8`` / Packaging: ``Reel`` / Lead-Free Status: ``Lead Free`` / RoHS: ``Compliant`` / Id [Continuous Drain Current]: { / ``uncertainty_minus``: null, / ``value``: -14.0, / ``uncertainty_plus``: null / } / Rds [Drain to Source Resistance] (on): { / ``uncertainty_minus``: null, / ``value``: 0.0075, / ``uncertainty_plus``: null / } / Vds [Drain to Source Voltage]: { / ``uncertainty_minus``: null, / ``value``: -20.0, / ``uncertainty_plus``: null / } / Power Dissipation: { / ``uncertainty_minus``: null, / ``value``: 1.5, / ``uncertainty_plus``: null / } / Breakdown Voltage [Gate to Source]: { / ``max_value``: 8.0, / ``max_uncertainty_plus``: null, / ``min_value``: -8.0, / ``min_uncertainty_plus``: null, / ``max_uncertainty_minus``: null / } / Number of Pins: 8; Obsolete: False; Temp_Max: 0; Type: All Parts; TypeNotes: Applies to all parts in the database; PartID: 2390; mfrPartNum: SI4423DY-T1-E3; URL_Image: http://cdn.sigma.octopart.com/9542269/image/Vishay-SI4423DY-T1-E3.jpg; URL_Datasheet: http://datasheet.octopart.com/SI4423DY-T1-E3-Vishay-datasheet-8542980.pdf; Date_Created: 8/20/2011 8:24:30 AM; Date_LastModified: 8/20/2011 8:24:30 AM; Verified: False; RoHS: True; Temp_Min: 0
RST1 = MOM-TACT-SW
S1 = SPDT-TH: SPDT slide right angle TH high current switch
T1 = DRQ127-100-XFORM-1:1
TVS1 = 2519: TVS 400W 12V BIDIRECT SMA; mfrName: Micro Commercial Co.; mfrPartNum: SMAJ12CA-TP; Extra_Description: Datasheets	SMAJ5.0 thru SMAJ440CA / Product Photos	SMA, DO-214AC BIDIRECT / Product Training Modules	Transient Voltage Suppressors / Diode Handling and Mounting / Catalog Drawings	SMA Series Top / Featured Product	Surface Mount TVS / Standard Package	1 / Category	Circuit Protection / Family	TVS - Diodes / Series	- / Voltage - Reverse Standoff (Typ)	12V / Voltage - Breakdown	13.3V / Power (Watts)	400W / Polarization	Bidirectional / Mounting Type	Surface Mount / Package / Case	DO-214AC, SMA / Supplier Device Package	SMA / Packaging	Cut Tape (CT) / Other Names	SMAJ12CA-TPMSCT; Obsolete: False; Temp_Max: 0; TypeNotes: Applies to all parts in the database; PartID: 2519; URL_Image: http://media.digikey.com/photos/Micro%20Commercial%20Photos/SMAJ8.5CA-TP.JPG; URL_Datasheet: http://61.222.192.61/mccsemi/up_pdf/SMAJ5.0~SMAJ440CA(SMA).pdf; Date_Created: 2/24/2012 10:06:52 PM; Date_LastModified: 2/24/2012 10:06:52 PM; Verified: False; RoHS: True; Temp_Min: 0; Type: All Parts
U1 = STM32F407: 176 pin ARM CORTEX-M4
U2 U4 = LT1790-Volt-Ref
U5 = OPA335
U6 U7 U10 U11 U13 U14 U17-U20 U22-U26 = INA21X-CurrentSenseAmp
U9 = LT1210-OpAmp
USB = USB MiniB: Mini USB; Published: 8-Jun-2000; LatestRevisionDate: 17-Jan-2003; LatestRevisionNote: PCB Footprint 'BCY-W3/D4.7' replaced; DatasheetDocument: 1997; PackageDocument: Sep-1998; PackageReference: TO-92A; Publisher: Altium Limited; ComponentLink1Description: Manufacturer Link; ComponentLink1URL: http://www.fairchildsemi.com/; ComponentLink2Description: Datasheet; ComponentLink2URL: http://www.fairchildsemi.com/ds/2N%2F2N3904.pdf
VPWR1 = 2Pin-PhoenixTerminalBlock